# Altium project Mopq.PrjPcb
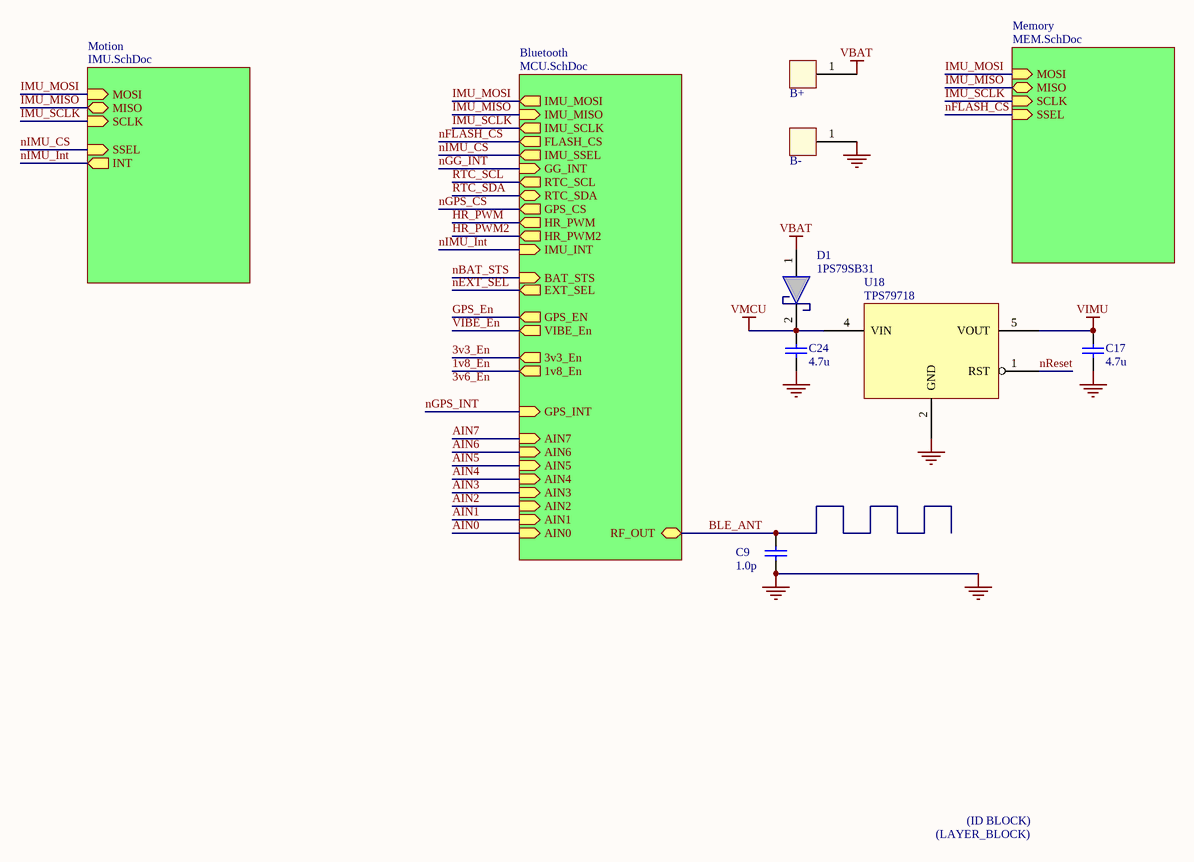
[diagram p0: Mopq.SchDoc]
4 sheets, 59 parts. Net scope: hierarchical (ports join the sheet entries above them; power ports are global).
Board files: Mopf.PcbDoc, Mopp.PcbDoc, Mopq.PcbDoc
Sheets:
  Mopq.SchDoc
    Bluetooth = MCU.SchDoc
    Memory = MEM.SchDoc
    Motion = IMU.SchDoc

## Sheet Mopq.SchDoc: Band
size Letter; DrawnBy: John Kelley; Organization: Hello Inc.; Address1: L3, 12a Rodborough Rd; Address2: Frenchs Forest; Address3: NSW; Address4: Australia 2086; Revision: EVT2; SheetNumber: 1; SheetTotal: 8

### Parts
*  LAYER_BLOCK  [Layer Stackup]  (value not drawn)  (no BOM)
B+  5016  [TP0875x050]  (value not drawn)
B-  5016  [TP0875x050]  (value not drawn)
C9  1.0p  [CAP0402]
C17  4.7u  [CAP0402]
C24  4.7u  [CAP0402]
D1  1PS79SB31  [SOD-523]
ID1  ID_BLOCK  [Hello Band]  (value not drawn)  (no BOM)
U18  TPS79718  [SOT65P212X110-5N]

### Sub-sheets
Bluetooth = MCU.SchDoc: IMU_MOSI (out), IMU_MISO (in), IMU_SCLK (out), HR_PWM (out), IMU_SSEL (out), FLASH_CS (out), IMU_INT (in), GPS_CS (out), GPS_EN (out), VIBE_En (out), 3v3_En (out), AIN6 (in), BAT_STS (in), HR_PWM2 (out), GPS_INT (in), GG_INT (in), RTC_SCL (out), RTC_SDA, AIN7 (in), EXT_SEL (out), 1v8_En (out), AIN4 (in), AIN5 (in), AIN2 (in), AIN3 (in), AIN0 (in), AIN1 (in), RF_OUT
Memory = MEM.SchDoc: SSEL (in), MOSI (in), MISO, SCLK (in)
Motion = IMU.SchDoc: MOSI (in), MISO, SCLK (in), INT (out), SSEL (in)

### Nets
GND: B-.1 C9.1 C17.1 C24.1 U18.2(GND)
VBAT: B+.1 D1.1(Anode)
VIMU: C17.2 U18.5(VOUT)
VMCU: C24.2 D1.2(Cathode) U18.4(VIN)
BLE_ANT: C9.2 ; sheet Bluetooth/RF_OUT
IMU_MISO: sheet Bluetooth/IMU_MISO, sheet Memory/MISO, sheet Motion/MISO
IMU_MOSI: sheet Bluetooth/IMU_MOSI, sheet Memory/MOSI, sheet Motion/MOSI
IMU_SCLK: sheet Bluetooth/IMU_SCLK, sheet Memory/SCLK, sheet Motion/SCLK
nFLASH_CS: sheet Bluetooth/FLASH_CS, sheet Memory/SSEL  [project net FLASH_CS]
nIMU_CS: sheet Bluetooth/IMU_SSEL, sheet Motion/SSEL  [project net IMU_CS]
nIMU_Int: sheet Bluetooth/IMU_INT, sheet Motion/INT  [project net IMU_INT]
nReset: U18.1(RST)

### Notes on the sheet
- Labels drawn without touching a wire or pin: 3v6_En
- TITLE
- DATE
- DRAWN BY
- REV
- SHEET
- OF
- (in symbol ID_BLOCK) (ID BLOCK)
- (in symbol LAYER_BLOCK) (LAYER_BLOCK)

### Library data of the parts
B+ B- = 5016: Single-pad test point
C9 = C_2200p_5_16_STD_0402: Chip capacitor; Vendor: Taiyo Yuden; PN: EMK100SD222JV-F; Tolerance: 5 %; Voltage: 16V; Temp: Standard; Value: 1.0p; Size: 0402
C17 C24 = C_4.7u_10_10_JB_0402: Chip capacitor; Vendor: TDK; PN: C1005JB1A475K050BC; Tolerance: 10%; Voltage: 10V; Temp: JB; Value: 4.7u; Size: 0402
D1 = 1PS79SB31: Schottky diode, 30V 200mA; Vendor: NXP; PN: 1PS79SB31
U18 = TPS79718DCK: LDO 1.8V SC70-5

## Sheet MCU.SchDoc: BLE MCU Sub-board
size Letter; Author: John Kelley; CompanyName: Hello, Inc.; DrawnBy: John Kelley; Engineer: John Kelley; Organization: Hello, Inc.; Address1: 1660 17th St; Address2: San Francisco, CA; Address3: 94107; Address4: http://www.sayhello.com; DocumentNumber: 2; Revision: EVT2; SheetNumber: 2; SheetTotal: 8; DocumentName: BLE MCU Sub-board; ProjectName: Hello Band
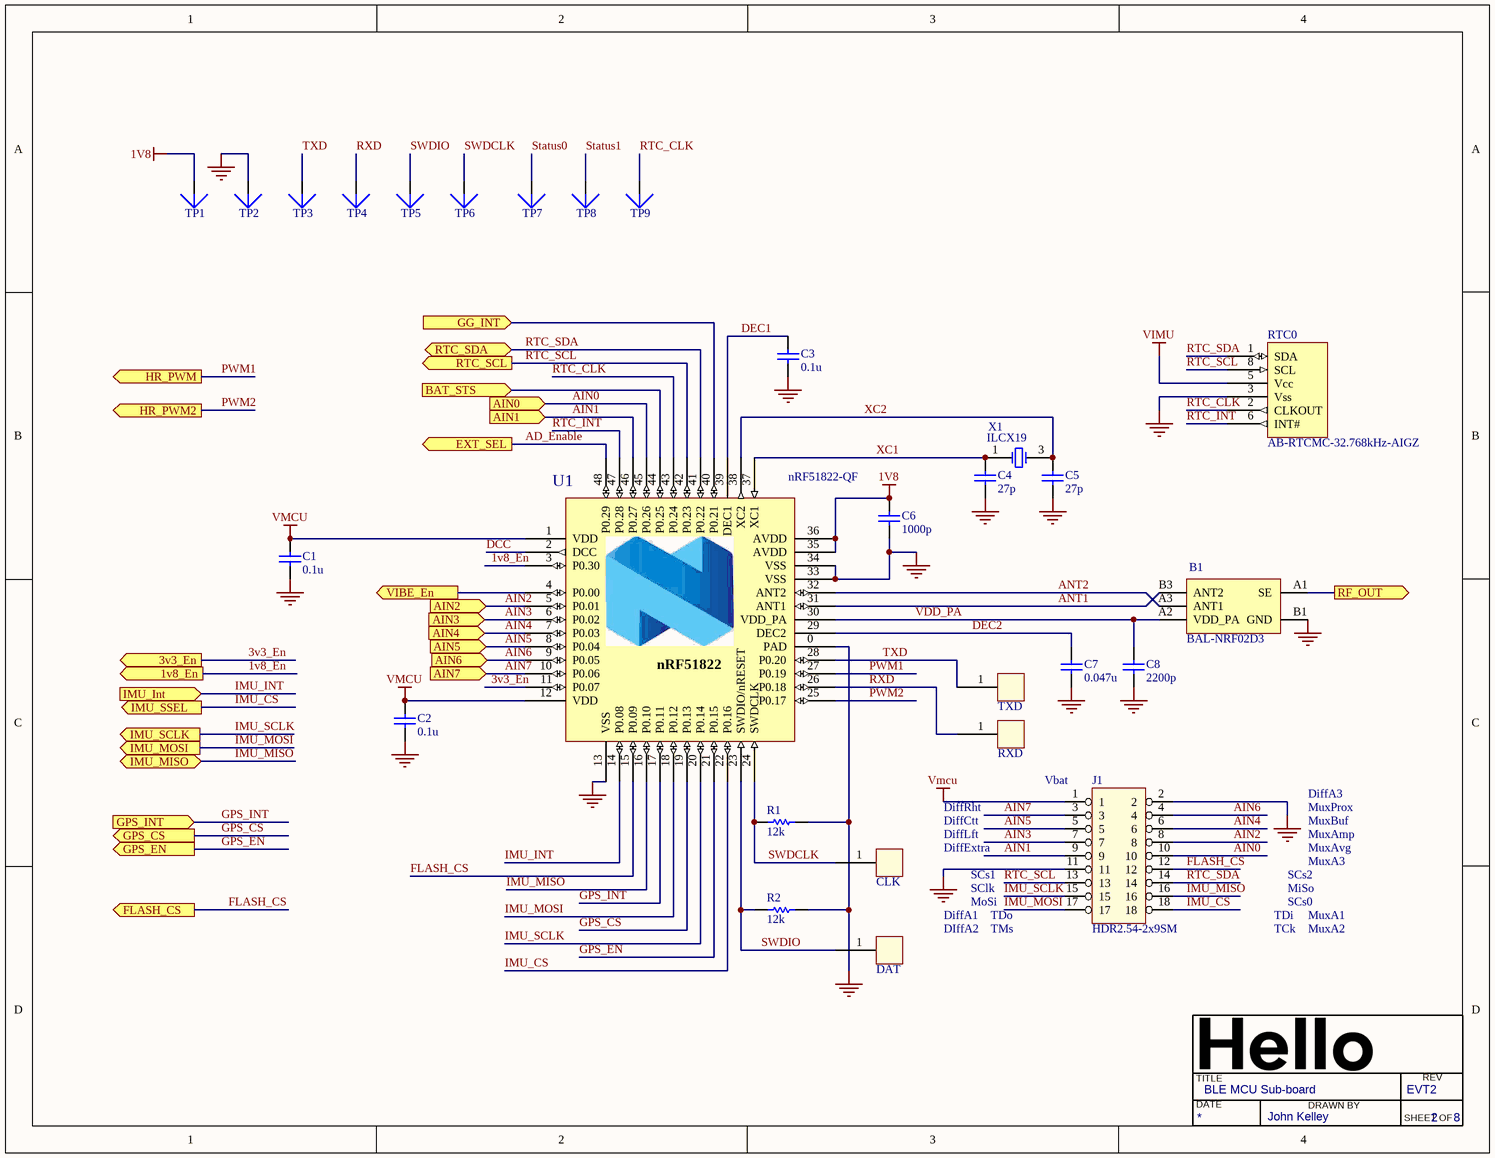
[diagram p1: MCU.SchDoc]

### Parts
B1  BAL-NRF02D3  [BAL-ST-WLCSP]
C1  0.1u  [CAP0201]
C2  0.1u  [CAP0201]
C3  0.1u  [CAP0201]
C4  27p  [CAP0201]
C5  27p  [CAP0201]
C6  1000p  [CAP0201]
C7  0.047u  [CAP0402]
C8  2200p  [CAP0402]
CLK  5016  [TP0875x050]  (value not drawn)
DAT  5016  [TP0875x050]  (value not drawn)
J1  HDR2.54-2x9SM  [HDR2.54-2X9]
R1  12k  [RES0402]
R2  12k  [RES0402]
RTC0  AB-RTCMC-32.768kHz-AIGZ  [8-CLCC]
RXD  5016  [TP0875x050]  (value not drawn)
TP1  TestPoint  [TP-0.3]  (value not drawn)
TP2  TestPoint  [TP-0.3]  (value not drawn)
TP3  TestPoint  [TP-0.3]  (value not drawn)
TP4  TestPoint  [TP-0.3]  (value not drawn)
TP5  TestPoint  [TP-0.3]  (value not drawn)
TP6  TestPoint  [TP-0.3]  (value not drawn)
TP7  TestPoint  [TP-0.3]  (value not drawn)
TP8  TestPoint  [TP-0.3]  (value not drawn)
TP9  TestPoint  [TP-0.3]  (value not drawn)
TXD  5016  [TP0875x050]  (value not drawn)
U1  nRF51822-QF  [VQFN40P600X600X100-48]
X1  ILCX19  [ILCX19]

### Ports
1v8_En (out), 3v3_En (out), AIN0 (in), AIN1 (in), AIN2 (in), AIN3 (in), AIN4 (in), AIN5 (in), AIN6 (in), AIN7 (in), BAT_STS (in), EXT_SEL (out), FLASH_CS (out), GG_INT (in), GPS_CS (out), GPS_EN (out), GPS_INT (in), HR_PWM2 (out), HR_PWM (out), IMU_Int (in), IMU_MISO, IMU_MOSI (out), IMU_SCLK (out), IMU_SSEL (out), RF_OUT (out), RTC_SCL (out), RTC_SDA, VIBE_En (out)

### Nets
1V8: C6.2 TP1.1 U1.35(AVDD) U1.36(AVDD)
GND: B1.B1(GND) C1.1 C2.1 C3.1 C4.1 C5.1 C6.1 C7.1 C8.1 J1.2 J1.11 R1.2 R2.2 RTC0.3(Vss) TP2.1 U1.0(PAD) U1.13(VSS) U1.33(VSS) U1.34(VSS)
VIMU: RTC0.5(Vcc)
VMCU: C1.2 C2.2 J1.1 U1.1(VDD) U1.12(VDD)
1v8_En: U1.3(P0.30) ; port 1v8_En
3v3_En: U1.11(P0.07) ; port 3v3_En
AD_Enable: U1.48(P0.29) ; port EXT_SEL
AIN0: J1.10 U1.45(P0.26) ; port AIN0
AIN1: J1.9 U1.46(P0.27) ; port AIN1
AIN2: J1.8 U1.5(P0.01) ; port AIN2
AIN3: J1.7 U1.6(P0.02) ; port AIN3
AIN4: J1.6 U1.7(P0.03) ; port AIN4
AIN5: J1.5 U1.8(P0.04) ; port AIN5
AIN6: J1.4 U1.9(P0.05) ; port AIN6
AIN7: J1.3 U1.10(P0.06) ; port AIN7
ANT1: B1.B3(ANT2) U1.31(ANT1)
ANT2: B1.A3(ANT1) U1.32(ANT2)
BLE_ANT: B1.A1(SE) ; port RF_OUT
DCC: U1.2(DCC)
DEC1: C3.2 U1.39(DEC1)
DEC2: C7.2 U1.29(DEC2)
FLASH_CS: J1.12 U1.15(P0.09) ; port FLASH_CS
GPS_CS: U1.19(P0.13) ; port GPS_CS
GPS_En: U1.21(P0.15) ; port GPS_EN
GPS_INT: U1.17(P0.11) ; port GPS_INT
IMU_CS: J1.18 U1.22(P0.16) ; port IMU_SSEL
IMU_INT: U1.14(P0.08) ; port IMU_Int
IMU_MISO: J1.16 U1.16(P0.10) ; port IMU_MISO
IMU_MOSI: J1.17 U1.18(P0.12) ; port IMU_MOSI
IMU_SCLK: J1.15 U1.20(P0.14) ; port IMU_SCLK
nBAT_STS: U1.44(P0.25) ; port BAT_STS
nGG_INT: U1.40(P0.21) ; port GG_INT
PWM1: U1.27(P0.19) ; port HR_PWM  [project net HR_PWM]
PWM2: U1.25(P0.17) ; port HR_PWM2  [project net HR_PWM2]
RTC_CLK: RTC0.2(CLKOUT) TP9.1 U1.43(P0.24)
RTC_INT: RTC0.6(INT#) U1.47(P0.28)
RTC_SCL: J1.13 RTC0.8(SCL) U1.42(P0.23) ; port RTC_SCL
RTC_SDA: J1.14 RTC0.1(SDA) U1.41(P0.22) ; port RTC_SDA
RXD: RXD.1 TP4.1 U1.26(P0.18)
Status0: TP7.1
Status1: TP8.1
SWDCLK: CLK.1 R1.1 TP6.1 U1.24(SWDCLK)
SWDIO: DAT.1 R2.1 TP5.1 U1.23(SWDIO/nRESET)
TXD: TP3.1 TXD.1 U1.28(P0.20)
VDD_PA: B1.A2(VDD_PA) C8.2 U1.30(VDD_PA)
VIBE_En: U1.4(P0.00) ; port VIBE_En
XC1: C4.2 U1.37(XC1) X1.1(XTAL1)
XC2: C5.2 U1.38(XC2) X1.3(XTAL2)

Not connected (* = marked no-connect by the designer): RTC0 4(NC) 7(NC)

### Notes on the sheet
- DiffRht
- DiffCtt
- DiffLft
- (near J1) Vbat
- DiffA3
- MuxProx
- MuxBuf
- MuxAmp
- DiffExtra
- SCs1
- SClk
- MoSi
- SCs2
- SCs0
- MiSo
- MuxAvg
- MuxA3
- DIffA2
- DiffA1
- TDo
- TMs
- TDi
- TCk
- MuxA2
- MuxA1
- TITLE
- DATE
- DRAWN BY
- REV
- SHEET
- OF
- (in symbol nRF51822_QF) nRF51822

### Library data of the parts
B1 = BAL-ST-5pin_DC-Flip: 50 ohm balun transformer for 2.45GHz ISM; Manufacturer: ST; Artikkelnr Noca: N.A.; Part Number: BAL-NRF02D3; Manufacturer Part Number: BAL-NRF02D3; Datasheet: *; LatestRevisionDate: 2013-05-15; Pin Count: 5; Publisher: Nordic Semiconductor; Published: 2013-05-15; Value: BAL-NRF02D3; Note: BAL-NRF02D3; Supplier: *; Supplier part number: *; 2nd source Supplier: *; 2nd source part number: *
C1-C3 = C_0.1u_10_10_X5R_0201: Chip capacitor; Vendor: Taiyo Yuden; PN: LMK063BJ104KP-F; Tolerance: 10%; Voltage: 10V; Temp: X5R; Value: 0.1u; Size: 0201
C4 C5 = C_27p_5_50_C0G_0201: Chip capacitor; Vendor: Taiyo Yuden; PN: UMK063CG270JT-F; Tolerance: 5 %; Voltage: 50V; Temp: C0G; Value: 27p; Size: 0201
C6 = C_1000p_10_25_X7R_0201: Chip capacitor; Vendor: Taiyo Yuden; PN: TMK063B7102KP-F; Tolerance: 10%; Voltage: 25V; Temp: X7R; Value: 1000p; Size: 0201
C7 = C_0.047u_10_16_X7R_0402: Chip capacitor; Vendor: Taiyo Yuden; PN: EMK105B7473KV-F; Tolerance: 10%; Voltage: 16V; Temp: X7R; Value: 0.047u; Size: 0402
C8 = C_2200p_5_16_STD_0402: Chip capacitor; Vendor: Taiyo Yuden; PN: EMK105SD222JV-F; Tolerance: 5 %; Voltage: 16V; Temp: Standard; Value: 2200p; Size: 0402
CLK DAT RXD TXD = 5016: Single-pad test point
R1 R2 = R_12k_0.5_0.063_0402: Chip Resistor; Vendor: Panasonic; Tolerance: 0.5 %; Power: 0.063 W; PN: ERA-2AED123X; Model: *; Value: 12k; Size: 0402
RTC0 = AB-RTCMC-32.768kHz-AIGZ: Abracon I2C RTC w/ integrated XO
TP1-TP9 = TestPoint: Generic Test Point
U1 = nRF51822_QF: Multi-protocol Bluetooth Low Energy and 2.4GHz proprietary system-on-chip; Manufacturer: Nordic Semiconductor; Note: nRF51822 - VQFN48 6x6 0.4mm pitch; Artikkelnr Noca: N.A.; Part Number: nRF51822-QF; Manufacturer Part Number: nRF51822-QF; Datasheet: *; Footprint: VQFN48; LatestRevisionDate: 2013-04-10; Pin Count: 48; Publisher: Nordic Semiconductor; Published: 2012-06-12; Value: nRF51822-QF; Supplier: Nordic Semiconductor; Supplier part number: *; 2nd source Supplier: *; 2nd source part number: *
X1 = ILCX19: ILSI ILCX19 Crystal Oscillator

## Sheet MEM.SchDoc: Storage Sub-board
size Letter; CompanyName: Hello Inc.; DrawnBy: John Kelley; Organization: Hello Inc.; Revision: EVT2; SheetNumber: 7; SheetTotal: 8
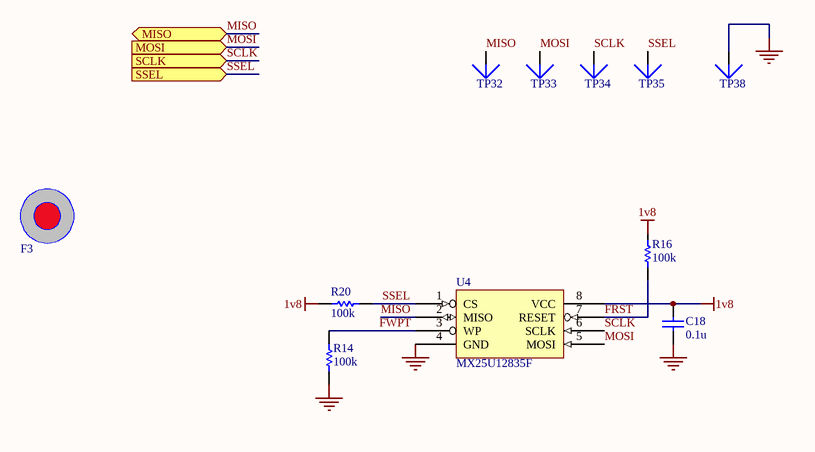
[diagram p2: MEM.SchDoc]

### Parts
C18  0.1u  [CAP0201]
F3  Fiducial  [Fiducial-0.5]  (value not drawn)  (no BOM)
R14  100k  [RES0201]
R16  100k  [RES0201]
R20  100k  [RES0201]
TP32  TestPoint  [TP-0.3]  (value not drawn)
TP33  TestPoint  [TP-0.3]  (value not drawn)
TP34  TestPoint  [TP-0.3]  (value not drawn)
TP35  TestPoint  [TP-0.3]  (value not drawn)
TP38  TestPoint  [TP-0.3]  (value not drawn)
U4  MX25U12835F  [WSON 8L]

### Ports
MISO, MOSI (in), SCLK (in), SSEL (in)

### Nets
1V8: C18.2 R20.1 U4.8(VCC)
GND: C18.1 R14.1 TP38.1 U4.4(GND)
FRST: R16.1 U4.7(RESET)
FWPT: R14.2 U4.3(WP)
MISO: TP32.1 U4.2(MISO) ; port MISO  [project net IMU_MISO]
MOSI: TP33.1 U4.5(MOSI) ; port MOSI  [project net IMU_MOSI]
SCLK: TP34.1 U4.6(SCLK) ; port SCLK  [project net IMU_SCLK]
SSEL: R20.2 TP35.1 U4.1(CS) ; port SSEL  [project net FLASH_CS]

Not connected (* = marked no-connect by the designer): R16 2

### Notes on the sheet
- Labels drawn without touching a wire or pin: 1v8
- TITLE
- DATE
- DRAWN BY
- REV
- SHEET
- OF

### Library data of the parts
C18 = C_0.1u_10_6.3_X5R_0201: Chip capacitor; Vendor: Taiyo Yuden; PN: JMK063BJ104KP-F; Tolerance: 10%; Voltage: 6.3; Temp: X5R; Value: 0.1u; Size: 0201
F3 = Fiducial-0.5: Fiducial with 0.5mm radius and 0.5mm paste expansion
R14 R16 R20 = R_100k_5_0.05_0201: Chip Resistor; Vendor: Panasonic; Tolerance: 5 %; Power: 0.05 W; PN: ERJ-1GEJ104C; Model: *; Value: 100k; Size: 0201
TP32-TP35 TP38 = TestPoint: Generic Test Point
U4 = MX25U12835F: Macronix MX25U12835F SPI NOR Flash

## Sheet IMU.SchDoc: IMU Sub-board
size Letter; CompanyName: Hello Inc.; DrawnBy: John Kelley; Organization: Hello Inc.; Revision: EVT2; SheetNumber: 3; SheetTotal: 8
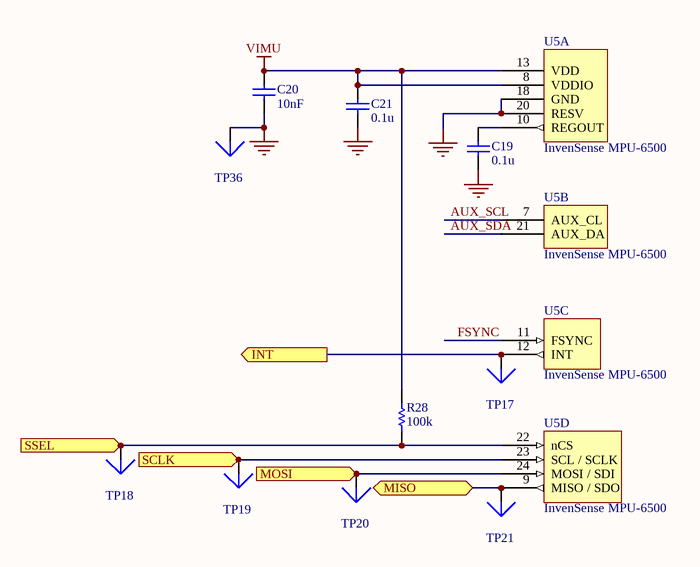
[diagram p3: IMU.SchDoc]

### Parts
C19  0.1u  [CAP0201]
C20  10nF  [CAP0201]
C21  0.1u  [CAP0201]
R28  100k  [RES0201]
TP17  TestPoint  [TP-0.3]  (value not drawn)
TP18  TestPoint  [TP-0.3]  (value not drawn)
TP19  TestPoint  [TP-0.3]  (value not drawn)
TP20  TestPoint  [TP-0.3]  (value not drawn)
TP21  TestPoint  [TP-0.3]  (value not drawn)
TP36  TestPoint  [TP-0.3]  (value not drawn)
U5  InvenSense MPU-6500  [QFN-24]  (parts A,B,C,D of 4)

### Ports
INT (out), MISO, MOSI (in), SCLK (in), SSEL (in)

### Nets
GND: C19.1 C20.1 C21.1 TP36.1 U5.18(GND) U5.20(RESV)
VIMU: C20.2 C21.2 R28.2 U5.8(VDDIO) U5.13(VDD)
AUX_SCL: U5.7(AUX_CL)
AUX_SDA: U5.21(AUX_DA)
FSYNC: U5.11(FSYNC)
IMU_CS: R28.1 TP18.1 U5.22(nCS) ; port SSEL
IMU_INT: TP17.1 U5.12(INT) ; port INT
IMU_MISO: TP21.1 U5.9(MISO_/_SDO) ; port MISO
IMU_MOSI: TP20.1 U5.24(MOSI_/_SDI) ; port MOSI
IMU_SCLK: TP19.1 U5.23(SCL_/_SCLK) ; port SCLK
NetC19_2: C19.2 U5.10(REGOUT)

### Notes on the sheet
- TITLE
- DATE
- DRAWN BY
- REV
- SHEET
- OF

### Library data of the parts
C19 C21 = C_0.1u_10_10_X5R_0201: as C1 on sheet MCU; Value: 0.1u; Size: 0201
C20 = CAP0201: Chip capacitor; Vendor: Murata; Model: GRM033R70J103KA01D; Voltage: 6.3v; Temp: X7R; Tolerance: 10%; Value: 10nF; Size: 0201
R28 = R_100k_5_0.05_0201: as R14 on sheet MEM; Model: *; Value: 100k; Size: 0201
TP17-TP21 TP36 = TestPoint: Generic Test Point
U5 = MPU-6500: InvenSense MPU-6500 6-axis accelerometer and gyroscope

## Nets that join several sheets
1V8: MCU (C6.2 TP1.1 U1.35 U1.36), MEM (C18.2 R20.1 U4.8)
GND: Mopq (5 pins), MCU (19 pins), MEM (C18.1 R14.1 TP38.1 U4.4), IMU (6 pins)
VIMU: Mopq (C17.2 U18.5), MCU (RTC0.5), IMU (5 pins)
VMCU: Mopq (C24.2 D1.2 U18.4), MCU (5 pins)
BLE_ANT: Mopq (C9.2), MCU (B1.A1)
FLASH_CS: MCU (J1.12 U1.15), MEM (R20.2 TP35.1 U4.1)
IMU_CS: MCU (J1.18 U1.22), IMU (R28.1 TP18.1 U5.22)
IMU_INT: MCU (U1.14), IMU (TP17.1 U5.12)
IMU_MISO: MCU (J1.16 U1.16), MEM (TP32.1 U4.2), IMU (TP21.1 U5.9)
IMU_MOSI: MCU (J1.17 U1.18), MEM (TP33.1 U4.5), IMU (TP20.1 U5.24)
IMU_SCLK: MCU (J1.15 U1.20), MEM (TP34.1 U4.6), IMU (TP19.1 U5.23)